# EAGLE design Board V.3 (EAGLE 7.2.0)

## Sheet 1 of 3
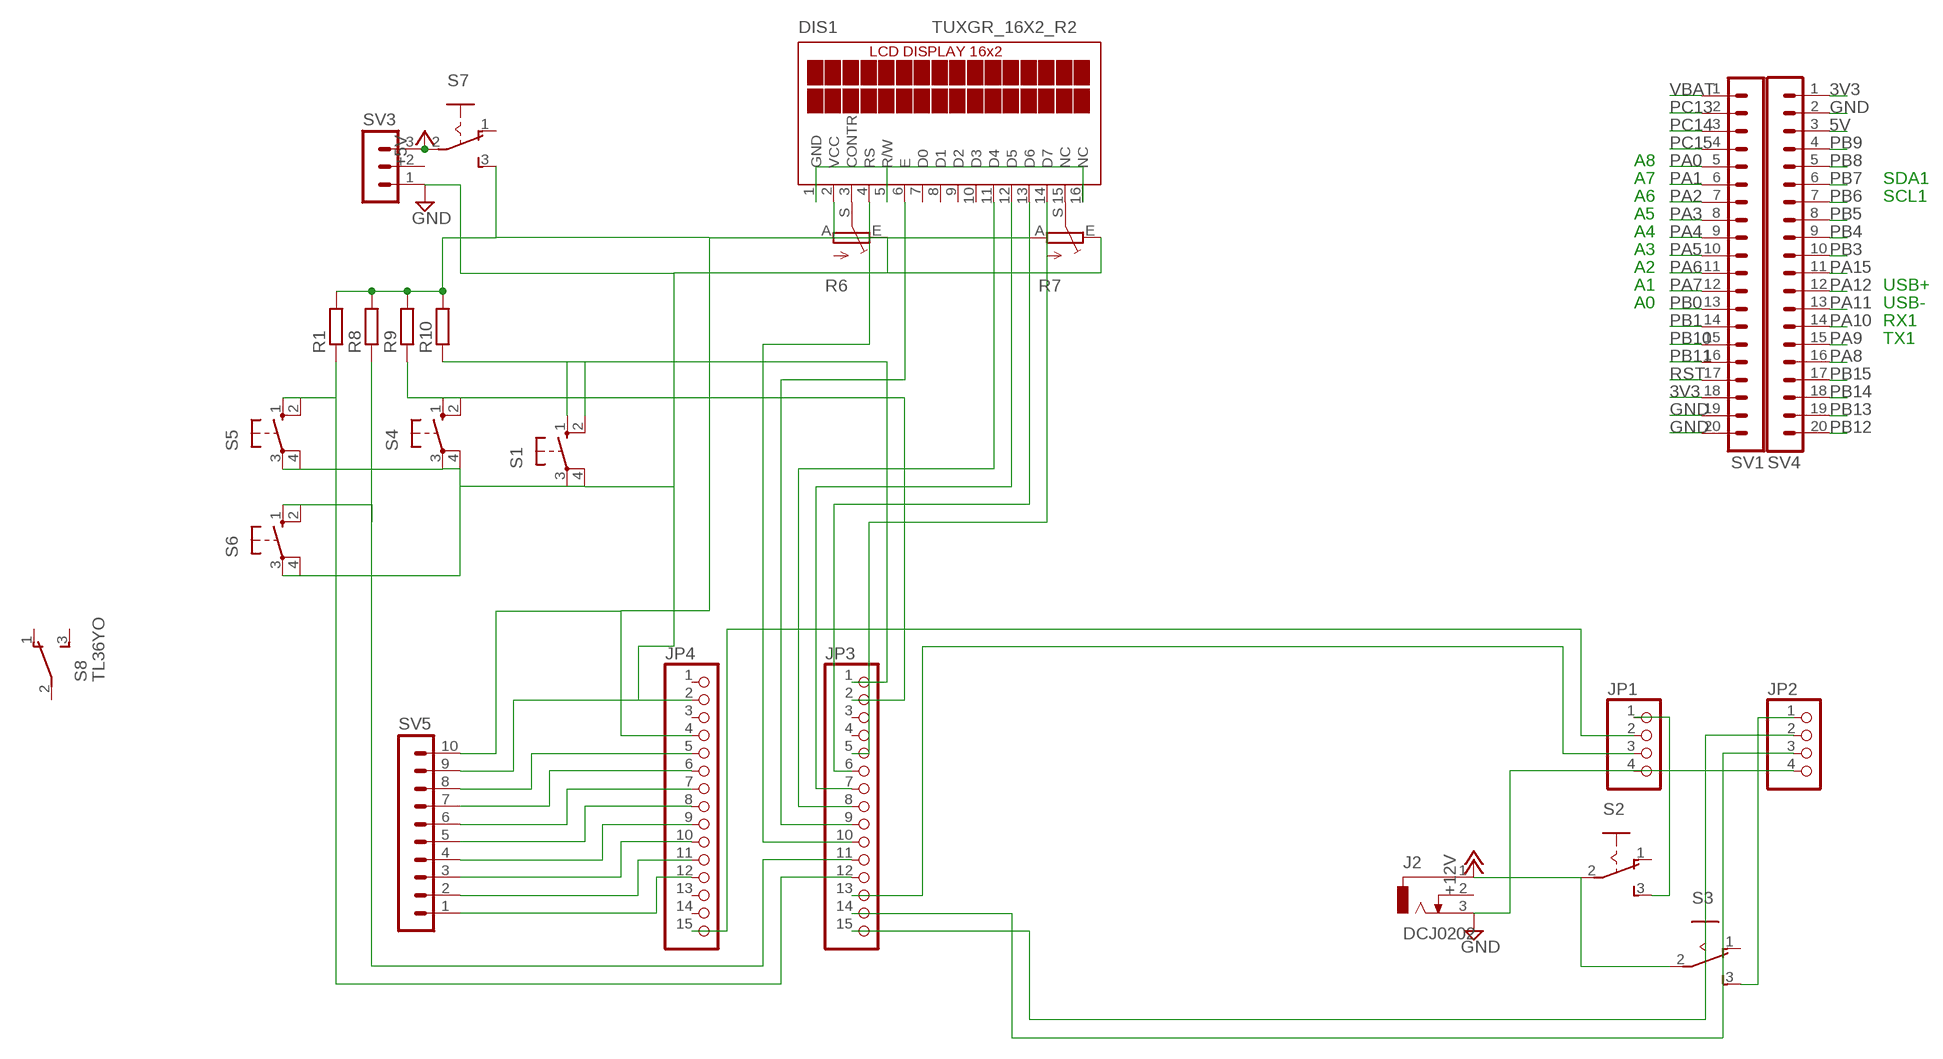
[diagram p0: schematic, sheet 1]

### Parts
DIS1  TUXGR_16X2_R2  [TUXGR_16X2_R2]
J2  DCJ0202  [DCJ0202]
JP1  PINHD-1X4  [1X04]
JP2  PINHD-1X4  [1X04]
JP3  PINHD-1X15  [1X15]
JP4  PINHD-1X15  [1X15]
R1  R-EU_0204/7  [0204/7]
R6  TRIM_EU-B25P  [B25P]
R7  TRIM_EU-B25P  [B25P]
R8  R-EU_0204/7  [0204/7]
R9  R-EU_0204/7  [0204/7]
R10  R-EU_0204/7  [0204/7]
S1  10-XX  [B3F-10XX]
S2  255SB  [255SB]
S3  255SB  [255SB]
S4  10-XX  [B3F-10XX]
S5  10-XX  [B3F-10XX]
S6  10-XX  [B3F-10XX]
S7  255SB  [255SB]
S8  TL36YO  [TL3XYO]
SV1  MA20-1L  [MA20-1L]
SV3  MA03-1  [MA03-1]
SV4  MA20-1L  [MA20-1L]
SV5  MA10-1  [MA10-1]

### Nets
3V3: SV1.18 SV4.1
5V: SV4.3
+5V: S7.2(P) SV3.3
+5V2: DIS1.2(VCC) JP4.4 R1.2 R6.A R7.A R8.2 R9.2 R10.2 S7.3(S) SV5.10
+12V: J2.1 S2.2(P) S3.2(P)
GND: J2.3 JP1.4 JP2.4 JP4.2 R6.E R7.E S1.3(P) S1.4(P1) S4.3(P) S4.4(P1) S5.3(P) S5.4(P1) S6.3(P) S6.4(P1) SV1.19 SV1.20 SV3.1 SV4.2 SV5.9
N$1: JP1.1 S2.3(S)
N$2: JP2.1 S3.3(S)
N$3: JP1.3
N$4: JP4.15
N$7: JP3.1 R10.1 S1.1(S) S1.2(S1)
N$9: DIS1.15(NC) R7.S
N$10: JP2.2
N$11: DIS1.4(RS) JP3.10
N$12: JP3.15
N$13: DIS1.3(CONTR) R6.S
N$14: DIS1.6(E) JP3.9
N$15: JP1.2
N$16: DIS1.11(D4) JP3.8
N$23: JP4.5 SV5.8
N$24: JP4.6 SV5.7
N$25: JP4.7 SV5.6
N$26: JP4.8 SV5.5
N$27: JP4.9 SV5.4
N$28: DIS1.12(D5) JP3.7
N$29: DIS1.13(D6) JP3.6
N$30: DIS1.14(D7) JP3.5
N$32: JP3.2 R9.1 S4.1(S) S4.2(S1)
N$33: JP3.11 R8.1 S6.1(S) S6.2(S1)
N$34: JP3.12 R1.1 S5.1(S) S5.2(S1)
N$36: DIS1.1(GND) DIS1.5(R/W) DIS1.16(NC)
N$40: JP3.13
N$45: JP2.3 JP3.14
N$46: JP4.10 SV5.3
N$47: JP4.11 SV5.2
N$49: JP4.12 SV5.1
PA0: SV1.5
PA1: SV1.6
PA2: SV1.7
PA3: SV1.8
PA4: SV1.9
PA5: SV1.10
PA6: SV1.11
PA7: SV1.12
PA8: SV4.16
PA9: SV4.15
PA10: SV4.14
PA11: SV4.13
PA12: SV4.12
PA15: SV4.11
PB0: SV1.13
PB1: SV1.14
PB3: SV4.10
PB4: SV4.9
PB5: SV4.8
PB6: SV4.7
PB7: SV4.6
PB8: SV4.5
PB9: SV4.4
PB10: SV1.15
PB11: SV1.16
PB12: SV4.20
PB13: SV4.19
PB14: SV4.18
PB15: SV4.17
PC13: SV1.2
PC14: SV1.3
PC15: SV1.4
RST: SV1.17
VBAT: SV1.1
Unconnected: DIS1.7(D0) DIS1.8(D1) DIS1.9(D2) DIS1.10(D3) J2.2 JP3.3 JP3.4 JP4.1 JP4.3 JP4.13 JP4.14 S2.1(O) S3.1(O) S7.1(O) S8.1(O) S8.2(P) S8.3(S) SV3.2

### Notes on the sheet
- A8
- A7 | SDA1
- A6 | SCL1
- A5
- A4
- A3
- A2
- A1 | USB+
- A0 | USB-
- RX1
- TX1

## Sheet 2 of 3
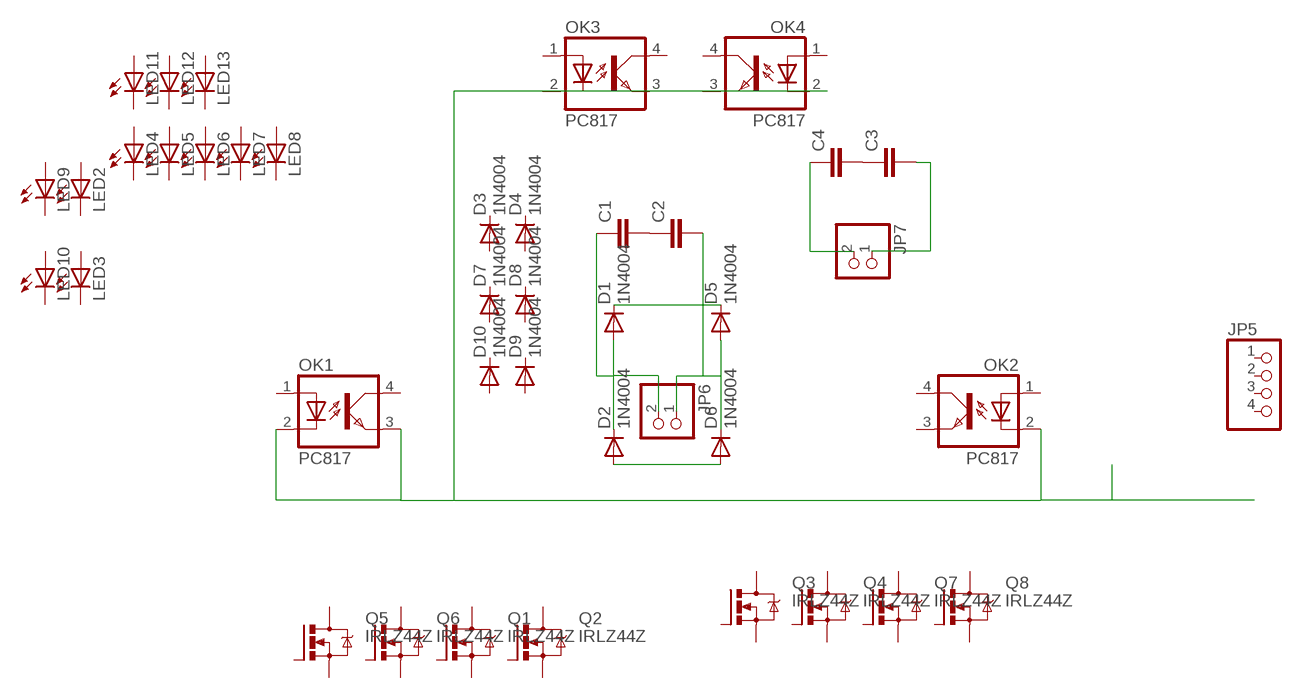
[diagram p1: schematic, sheet 2]

### Parts
C1  C-EU025-025X050  [C025-025X050]
C2  C-EU025-025X050  [C025-025X050]
C3  C-EU025-025X050  [C025-025X050]
C4  C-EU025-025X050  [C025-025X050]
D1  1N4004  [DO41-10]
D2  1N4004  [DO41-10]
D3  1N4004  [DO41-10]
D4  1N4004  [DO41-10]
D5  1N4004  [DO41-10]
D6  1N4004  [DO41-10]
D7  1N4004  [DO41-10]
D8  1N4004  [DO41-10]
D9  1N4004  [DO41-10]
D10  1N4004  [DO41-10]
JP5  PINHD-1X4  [1X04]
JP6  PINHD-1X2/90  [1X02/90]
JP7  PINHD-1X2/90  [1X02/90]
LED2  LED5MM  [LED5MM]
LED3  LED5MM  [LED5MM]
LED4  LED5MM  [LED5MM]
LED5  LED5MM  [LED5MM]
LED6  LED5MM  [LED5MM]
LED7  LED5MM  [LED5MM]
LED8  LED5MM  [LED5MM]
LED9  LED5MM  [LED5MM]
LED10  LED5MM  [LED5MM]
LED11  LED5MM  [LED5MM]
LED12  LED5MM  [LED5MM]
LED13  LED5MM  [LED5MM]
OK1  PC817  [DIL04]
OK2  PC817  [DIL04]
OK3  PC817  [DIL04]
OK4  PC817  [DIL04]
Q1  IRLZ44Z  [TO220BH]
Q2  IRLZ44Z  [TO220BH]
Q3  IRLZ44Z  [TO220BH]
Q4  IRLZ44Z  [TO220BH]
Q5  IRLZ44Z  [TO220BH]
Q6  IRLZ44Z  [TO220BH]
Q7  IRLZ44Z  [TO220BH]
Q8  IRLZ44Z  [TO220BH]

### Nets
+12V1: D1.C D5.C
GND1: OK1.2(C) OK1.3(EMIT) OK2.2(C) OK3.2(C) OK3.3(EMIT) OK4.2(C) OK4.3(EMIT)
N$17: C3.1 C4.2
N$18: D2.A D6.A
N$19: C4.1 JP7.2
N$22: C1.2 C2.1
N$58: C1.1 D1.A D2.C JP6.2
N$61: C3.2 JP7.1
N$67: C2.2 D5.A D6.C JP6.1
Unconnected: D3.A D3.C D4.A D4.C D7.A D7.C D8.A D8.C D9.A D9.C D10.A D10.C JP5.1 JP5.2 JP5.3 JP5.4 LED2.A LED2.K(C) LED3.A LED3.K(C) LED4.A LED4.K(C) LED5.A LED5.K(C) LED6.A LED6.K(C) LED7.A LED7.K(C) LED8.A LED8.K(C) LED9.A LED9.K(C) LED10.A LED10.K(C) LED11.A LED11.K(C) LED12.A LED12.K(C) LED13.A LED13.K(C) OK1.1(A) OK1.4(COL) OK2.1(A) OK2.3(EMIT) OK2.4(COL) OK3.1(A) OK3.4(COL) OK4.1(A) OK4.4(COL) Q1.D Q1.G Q1.S Q2.D Q2.G Q2.S Q3.D Q3.G Q3.S Q4.D Q4.G Q4.S Q5.D Q5.G Q5.S Q6.D Q6.G Q6.S Q7.D Q7.G Q7.S Q8.D Q8.G Q8.S

## Sheet 3 of 3

## Library data of the parts
C1-C4 = rcl:C-EU: CAPACITOR, European symbol
D1-D10 = diode:1N4004: DIODE general purpose rectifier, 1 A
DIS1 = display-lcd:TUXGR_16X2_R2: Tuxgraphics LCD display 16x2 characters reflective, without background light Source: tuxgr_12x2_r2.pdf
J2 = con-jack:DCJ0202: DC POWER JACK Source: DCJ0202.pdf
JP1 JP2 JP5 = pinhead:PINHD-1X4: PIN HEADER
JP3 JP4 = pinhead:PINHD-1X15: PIN HEADER
JP6 JP7 = pinhead:PINHD-1X2: PIN HEADER
LED2-LED13 = adafruit:LED: LED OSRAM: - CHIPLED LG R971, LG N971, LY N971, LG Q971, LY Q971, LO R971, LY R971 LH N974, LH R974 LS Q976, LO Q976, LY Q976 LO Q996 - Hyper CHIPLED LW Q18S LB Q993, LB Q99A, LB R99A - SideLED LS A670, LO A670, LY A670, LG A670, LP A670 LB A673, LV A673, LT A673, LW A673 LH A674 LY A675 LS A676, LA A676, LO A676, LY A676, LW A676 LS A679, LY A679, LG A679 - Hyper Micro SIDELED® LS Y876, LA Y876, LO Y876, LY Y876 LT Y87S - SmartLED LW L88C, LW L88S LB L89C, LB L89S, LG L890 LS L89K, LO L89K, LY L89K LS L896, LA L896, LO L896, LY L896 - TOPLED LS T670, LO T670, LY T670, LG T670, LP T670 LSG T670, LSP T670, LSY T670, LOP T670, LYG T670 LG T671, LOG T671, LSG T671 LB T673, LV T673, LT T673, LW T673 LH T674 LS T676, LA T676, LO T676, LY T676, LB T676, LH T676, LSB T676, LW T676 LB T67C, LV T67C, LT T67C, LS T67K, LO T67K, LY T67K, LW E67C LS E67B, LA E67B, LO E67B, LY E67B, LB E67C, LV E67C, LT E67C LW T67C LS T679, LY T679, LG T679 LS T770, LO T770, LY T770, LG T770, LP T770 LB T773, LV T773, LT T773, LW T773 LH T774 LS E675, LA E675, LY E675, LS T675 LS T776, LA T776, LO T776, LY T776, LB T776 LHGB T686 LT T68C, LB T68C - Hyper Mini TOPLED® LB M676 - Mini TOPLED Santana® LG M470 LS M47K, LO M47K, LY M47K Source: http://www.osram.convergy.de/
OK1-OK4 = optocoupler:PC817: SHARP OPTO COUPLER; MPN: PC817X4J000F; OC_FARNELL: 9707727; OC_NEWARK: 97K7059
Q1-Q8 = transistor-power:IRLZ44Z: N-Channel HEXFET® Power MOSFET Logic Level AUTOMOTIVE MOSFET Source: http://www.irf.com/product-info/datasheets/data/irlz44zpbf.pdf
R1 R8-R10 = resistor:R-EU_: RESISTOR, European symbol
R6 R7 = pot:TRIM_EU-: POTENTIOMETER
S1 S4-S6 = switch-omron:10-XX: OMRON SWITCH
S2 S3 S7 = switch:255SB: SLIDING SWITCH Distributor Buerklin, 11G810
S8 = switch:TL36YO: TINY SWITCH ON - ON Source: http://www2.produktinfo.conrad.com/datenblaetter/700000-724999/705152-da-01-de-Subminiaturschalter_TL_36YO.pdf
SV1 SV4 = con-lstb:MA20-1L: PIN HEADER; OC_FARNELL: unknown; OC_NEWARK: unknown
SV3 = con-lstb:MA03-1: PIN HEADER
SV5 = con-lstb:MA10-1: PIN HEADER

## Net classes
0 default: width 0.051 mm, clearance 0.051 mm

## Board
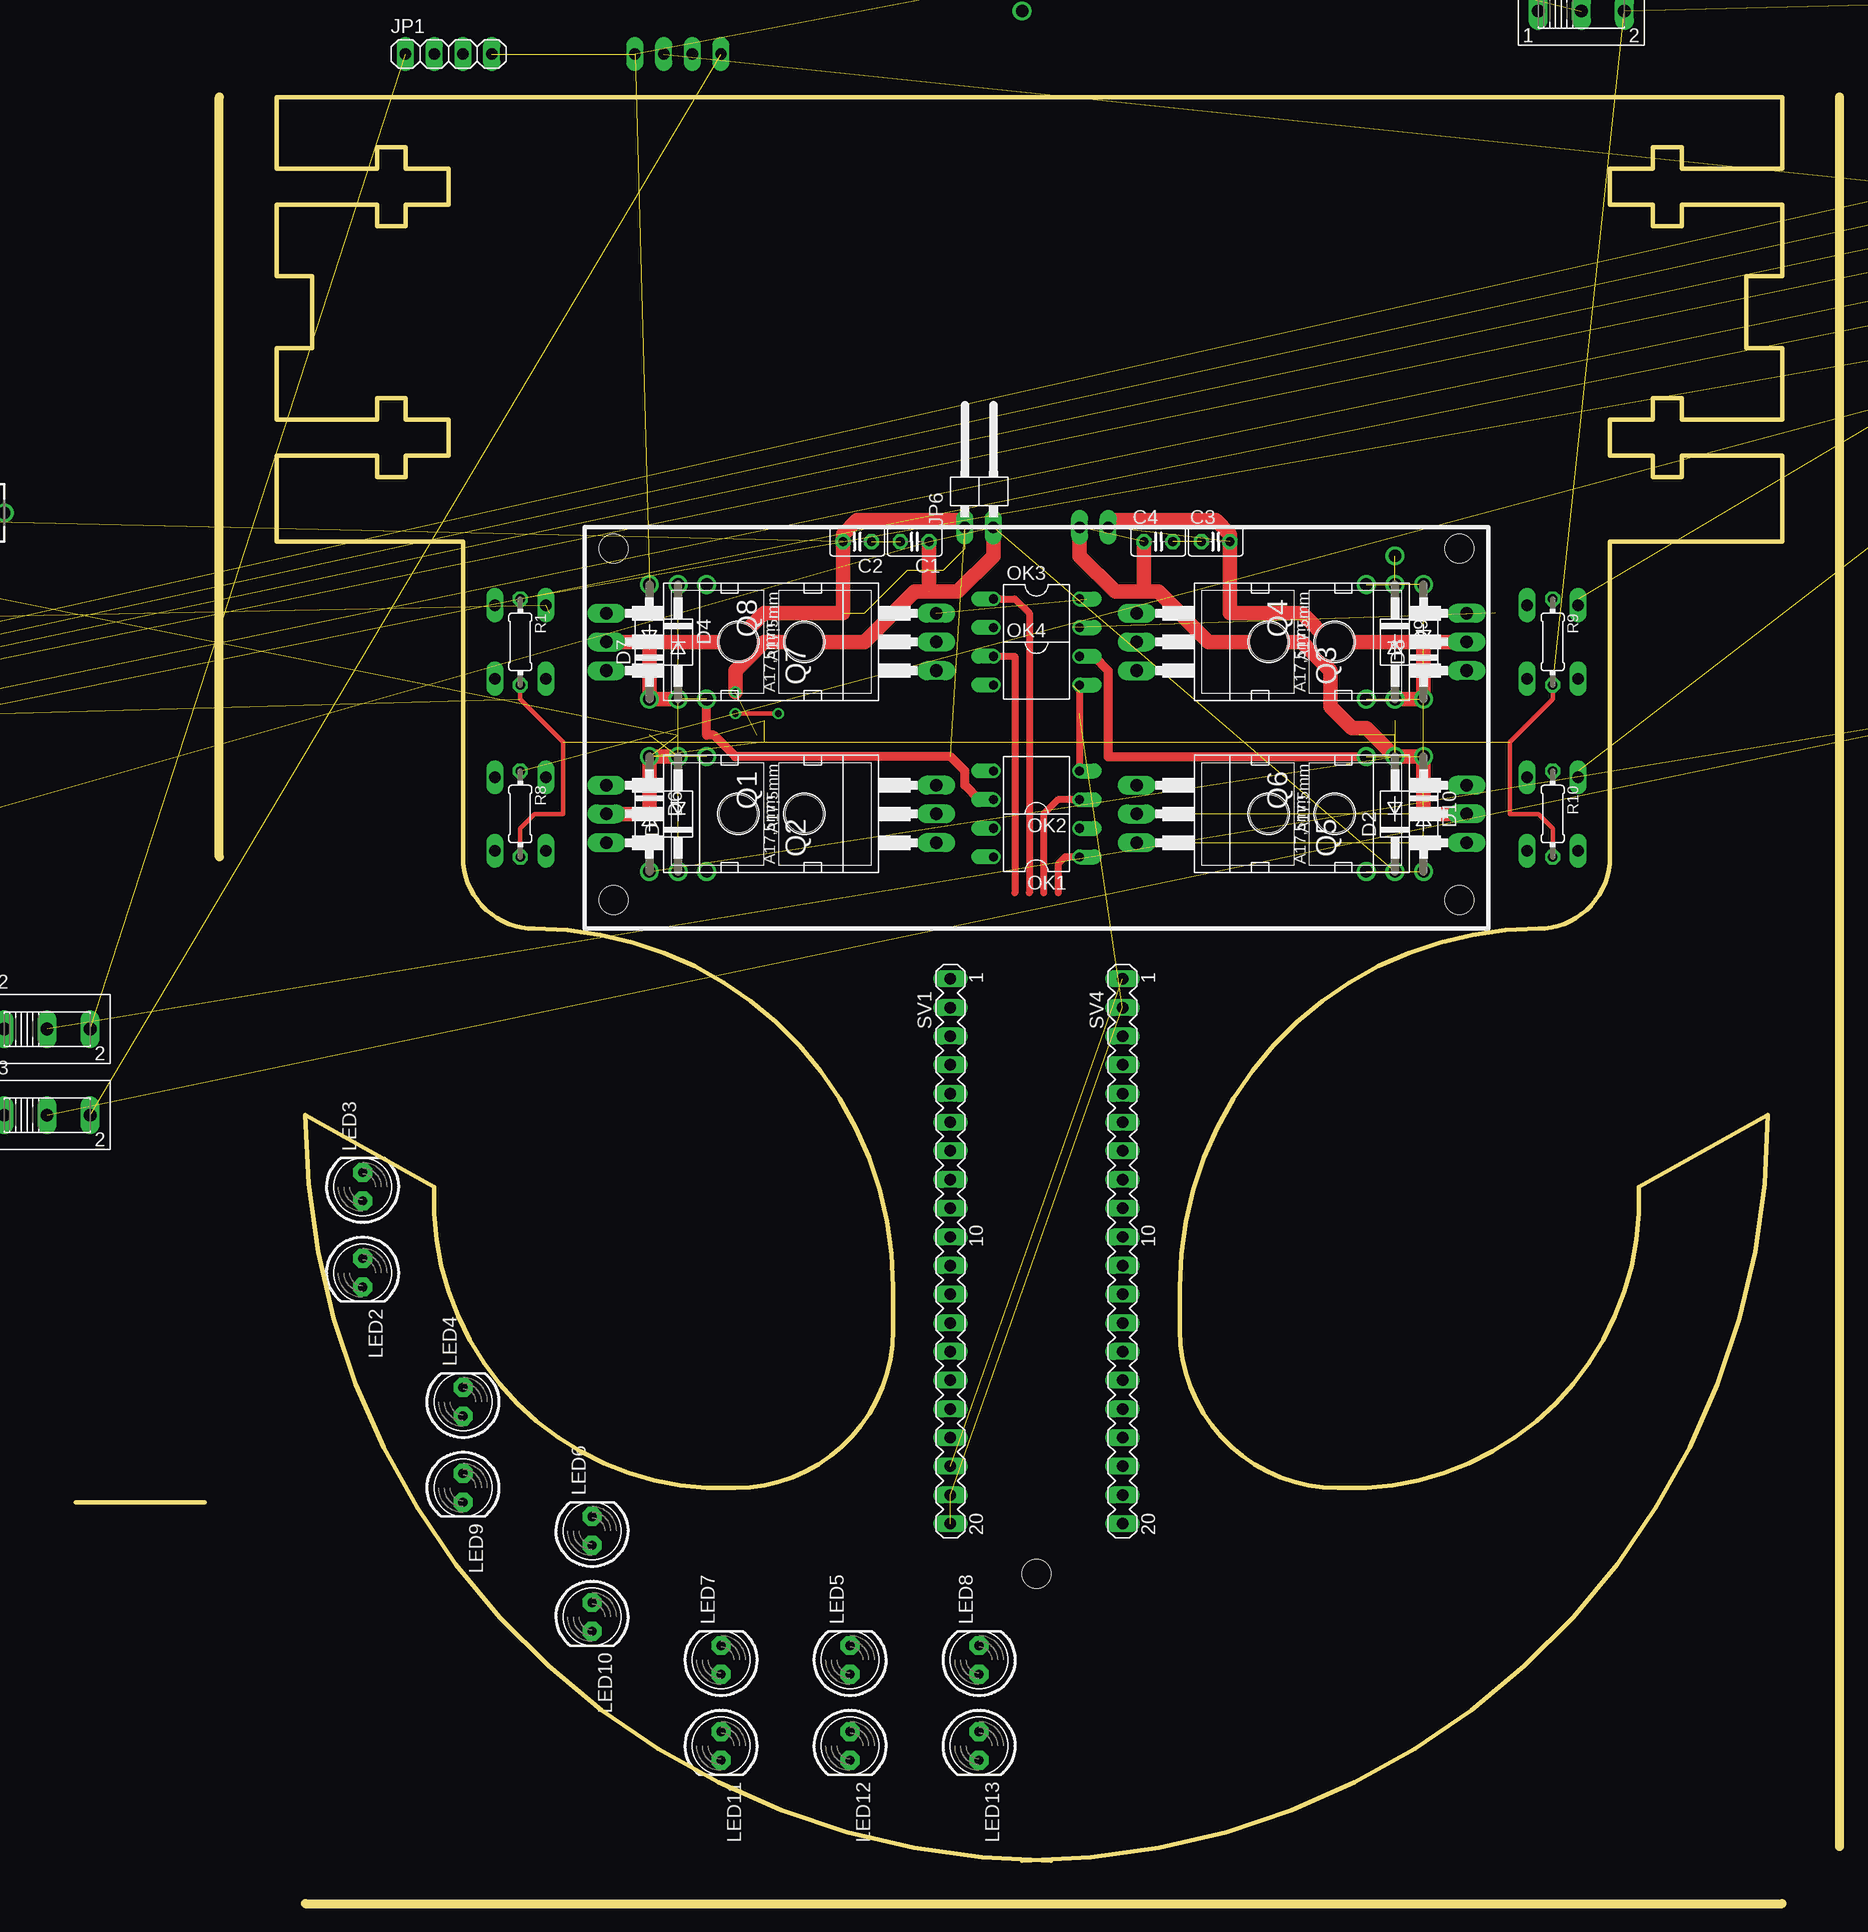
[diagram p2: board, top side]
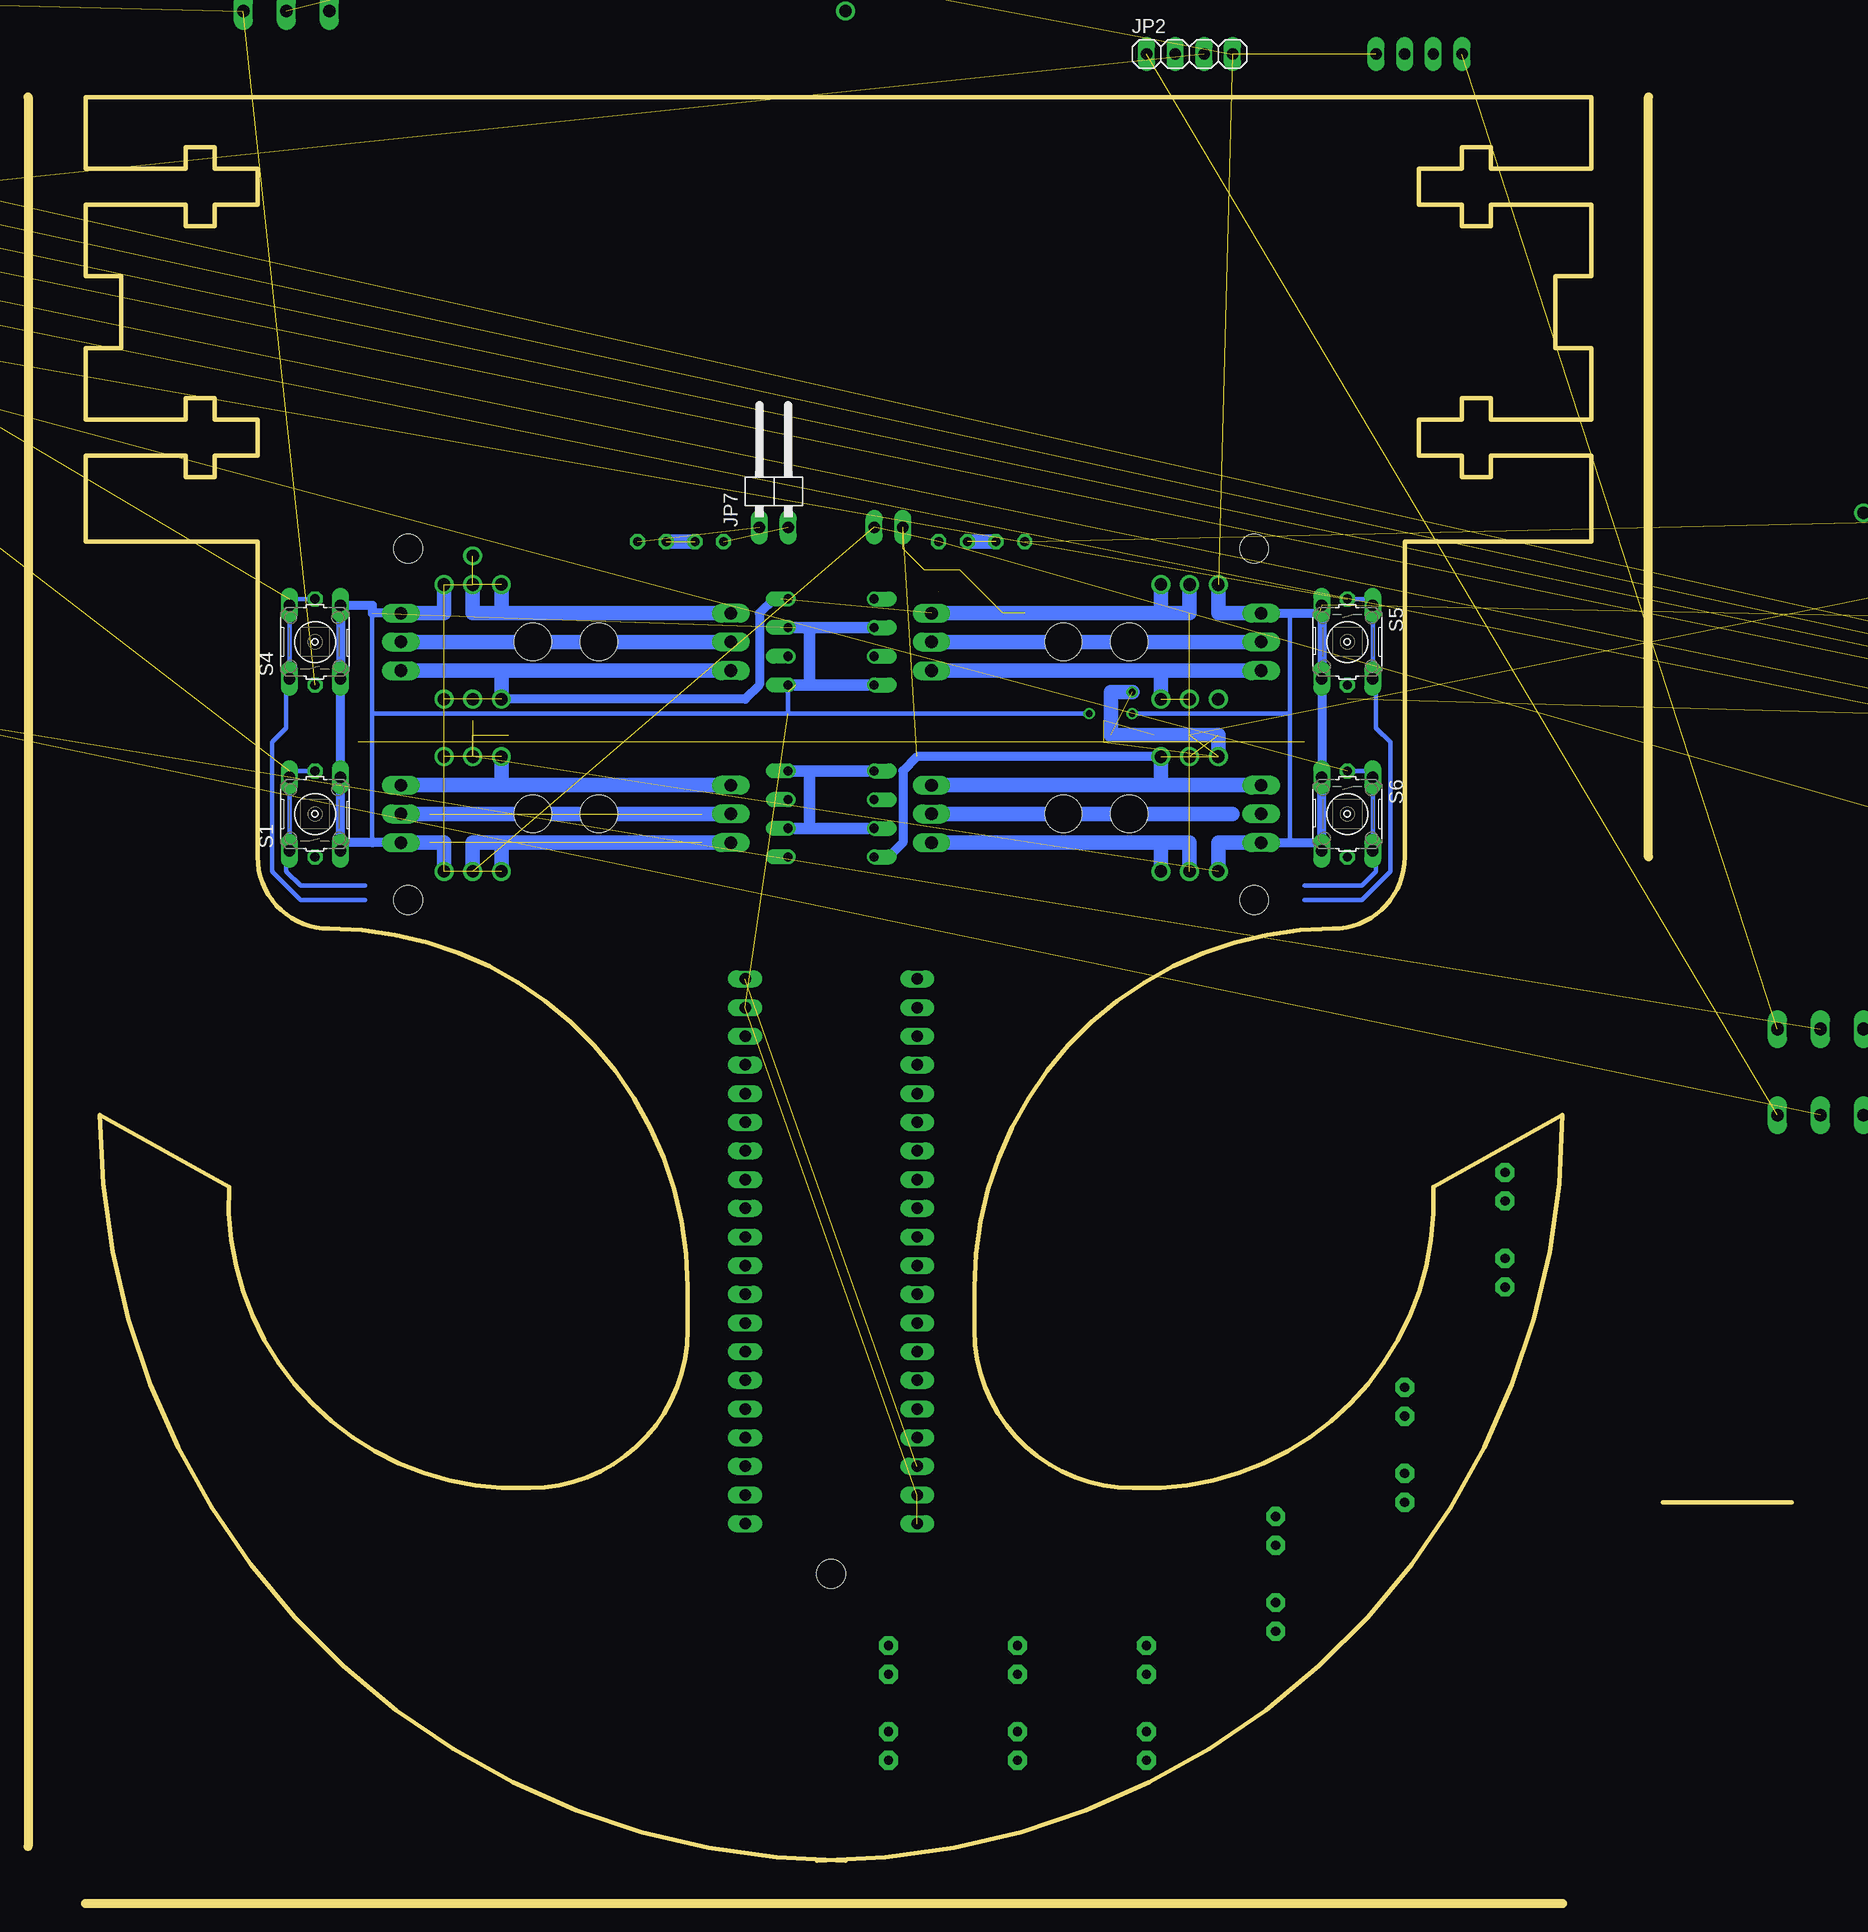
[diagram p3: board, bottom side, seen from below]

Size 156.21 x 160.02 mm. Coordinates in mm from the lower left corner, seen from the top.
Outline: 86.36,3.81 arc-90 20.32,69.85 31.75,63.5 arc90 55.88,36.83 58.42,36.83 arc90 72.39,50.8 72.39,54.61 arc90 40.64,86.36 arc-90 34.29,92.71 34.29,120.65 17.78,120.65 17.78,128.27 26.67,128.27 26.67,126.37 29.21,126.37 29.21,128.27 33.02,128.27 33.02,131.44 29.21,131.44 29.21,133.35 26.67,133.35 26.67,131.44 17.78,131.44 17.78,137.8 20.96,137.8 20.96,144.15 17.78,144.15 17.78,150.5 26.67,150.5 26.67,148.59 29.21,148.59 29.21,150.5 33.02,150.5 33.02,153.67 29.21,153.67 29.21,155.57 26.67,155.57 26.67,153.67 17.78,153.67 17.78,160.02 151.13,160.02 151.13,153.67 142.24,153.67 142.24,155.57 139.7,155.57 139.7,153.67 135.89,153.67 135.89,150.5 139.7,150.5 139.7,148.59 142.24,148.59 142.24,150.5 151.13,150.5 151.13,144.15 147.96,144.15 147.96,137.8 151.13,137.8 151.13,131.44 142.24,131.44 142.24,133.35 139.7,133.35 139.7,131.44 135.89,131.44 135.89,128.27 139.7,128.27 139.7,126.37 142.24,126.37 142.24,128.27 151.13,128.27 151.13,120.65 135.89,120.65 135.89,92.71 arc-90 129.54,86.36 arc90 97.79,54.61 97.79,50.8 arc90 111.76,36.83 114.3,36.83 arc90 138.43,63.5 149.86,69.85 arc-90 83.82,3.81
Outline: 156.21,160.02 156.21,5.08
Outline: 20.32,0 151.13,0
Outline: 12.7,92.71 12.7,160.02
Outline: 0,35.56 11.43,35.56
Copper layers (1*16): Top 0.035mm / dielectric 1.5mm / Bottom 0.035mm
Design rules "default *": minimum track width 20mil, minimum drill 24mil, track to track 8mil, track to pad 8mil, pad to pad 8mil, via to via 8mil, smd to smd 8mil, copper to edge 40mil, drill to drill 8mil, minimum pad ring 10mil, minimum via ring 8mil, stop-mask expansion 4mil, vias tented up to drill 0mil, thermal gap 10mil
Holes 2.54 mm at 85.09,29.21 47.62,88.9 47.62,120.02 122.56,120.02 122.56,88.9

### Footprints (pad centres in the part's own frame; a part is rotated, then mirrored left to right if it is on the bottom)
C025-025X050 = drill 0.813 octagon: 1 -1.27,0; 2 1.27,0
DO41-10 = drill 1.118: A 5.08,0; C -5.08,0
TUXGR_16X2_R2 = drill 1 pad 1.676: 1 -32,15.5; 2 -29.46,15.5; 3 -26.92,15.5; 4 -24.38,15.5; 5 -21.84,15.5; 6 -19.3,15.5; 7 -16.76,15.5; 8 -14.22,15.5; 9 -11.68,15.5; 10 -9.14,15.5; 11 -6.6,15.5; 12 -4.06,15.5; 13 -1.52,15.5; 14 1.02,15.5; 15 3.56,15.5; 16 6.1,15.5 | hole 2.5: -37.5,-15.5; 37.5,-15.5; -37.5,15.5; 37.5,15.5
DCJ0202 = drill 1 pad 2 long: 1 0,3.1; 2 4.8,0; 3 0,-3
1X04 = drill 1.016 long: 1 -3.81,0; 2 -1.27,0; 3 1.27,0; 4 3.81,0
1X15 = drill 1.016 long: 1 -17.78,0; 2 -15.24,0; 3 -12.7,0; 4 -10.16,0; 5 -7.62,0; 6 -5.08,0; 7 -2.54,0; 8 0,0; 9 2.54,0; 10 5.08,0; 11 7.62,0; 12 10.16,0; 13 12.7,0; 14 15.24,0; 15 17.78,0
1X02/90 = drill 1.016 long: 1 -1.27,-3.81; 2 1.27,-3.81
LED5MM = drill 0.813 pad 1.676 octagon: A -1.27,0; K 1.27,0
DIL04 = drill 0.813 offset: 1 -1.27,-3.81; 2 1.27,-3.81; 3 1.27,3.81; 4 -1.27,3.81
TO220BH = drill 1.118 long: D 0,-6.35; G -2.54,-6.35; S 2.54,-6.35 | hole 3.302: 0,11.176
0204/7 = drill 0.813 octagon: 1 -3.81,0; 2 3.81,0
B25P = drill 0.813 octagon: A -2.54,0; E 2.54,0; S 0,2.54
B3F-10XX = drill 1.016 long: 1 -3.251,2.261; 2 3.251,2.261; 3 -3.251,-2.261; 4 3.251,-2.261
255SB = drill 1.118 long: 1 -3.81,0; 2 0,0; 3 3.81,0
TL3XYO = drill 1.1 pad 1.422 long: 1 -2.54,0; 2 0,0; 3 2.54,0 | drill 1.1 pad 1.676: M1 -5.08,0; M2 5.08,0
MA20-1L = drill 1.016 long: 1 24.13,0; 2 21.59,0; 3 19.05,0; 4 16.51,0; 5 13.97,0; 6 11.43,0; 7 8.89,0; 8 6.35,0; 9 3.81,0; 10 1.27,0; 11 -1.27,0; 12 -3.81,0; 13 -6.35,0; 14 -8.89,0; 15 -11.43,0; 16 -13.97,0; 17 -16.51,0; 18 -19.05,0; 19 -21.59,0; 20 -24.13,0
MA03-1 = drill 1.016 long: 1 -2.54,0; 2 0,0; 3 2.54,0
MA10-1 = drill 1.016 long: 1 -11.43,0; 2 -8.89,0; 3 -6.35,0; 4 -3.81,0; 5 -1.27,0; 6 1.27,0; 7 3.81,0; 8 6.35,0; 9 8.89,0; 10 11.43,0

### Placement (x,y rotation side)
C1  74.3,120.65 180 top
C2  69.22,120.65 180 top
C3  100.97,120.65 0 top
C4  95.88,120.65 0 top
D1  -17.78,99.06 270 top  (outside the outline)
D2  116.84,96.52 90 top
D3  53.34,96.52 90 top
D4  53.34,111.76 270 top
D5  -44.45,118.11 90 top  (outside the outline)
D6  50.8,96.52 270 top
D7  50.8,111.76 90 top
D8  119.38,111.76 90 top
D9  116.84,111.76 270 top
D10  119.38,96.52 270 top
DIS1  -105.41,106.68 180 top  (outside the outline)
J2  171.45,109.22 180 top  (outside the outline)
JP1  33.02,163.83 0 top  (outside the outline)
JP2  53.34,163.83 0 bottom  (outside the outline)
JP3  233.68,160.02 270 top  (outside the outline)
JP4  240.03,160.02 270 top  (outside the outline)
JP5  -87.63,144.78 270 top  (outside the outline)
JP6  80.01,125.73 0 top
JP7  90.17,125.73 0 bottom
LED2  25.4,55.88 270 top
LED3  25.4,63.5 90 top
LED4  34.29,44.45 90 top
LED5  68.58,21.59 90 top
LED6  45.72,33.02 90 top
LED7  57.15,21.59 90 top
LED8  80.01,21.59 90 top
LED9  34.29,36.83 270 top
LED10  45.72,25.4 270 top
LED11  57.15,13.97 270 top
LED12  68.58,13.97 270 top
LED13  80.01,13.97 270 top
OK1  85.09,93.98 90 top
OK2  85.09,99.06 90 top
OK3  85.09,114.3 270 top
OK4  85.09,109.22 270 top
Q1  53.34,96.52 270 top
Q2  69.85,96.52 90 top
Q3  116.84,111.76 90 top
Q4  100.33,111.76 270 top
Q5  116.84,96.52 90 top
Q6  100.33,96.52 270 top
Q7  69.85,111.76 90 top
Q8  53.34,111.76 270 top
R1  39.37,111.76 270 top
R6  -55.88,113.03 180 top  (outside the outline)
R7  -55.88,104.14 180 top  (outside the outline)
R8  39.37,96.52 270 top
R9  130.81,111.76 270 top
R10  130.81,96.52 270 top
S1  130.81,96.52 90 bottom
S2  -2.54,77.47 0 top
S3  -2.54,69.85 0 top
S4  130.81,111.76 90 bottom
S5  39.37,111.76 270 bottom
S6  39.37,96.52 270 bottom
S7  133.35,167.64 0 top  (outside the outline)
S8  -11.43,123.19 0 top  (outside the outline)
SV1  77.47,57.78 90 top
SV3  105.41,173.99 0 top  (outside the outline)
SV4  92.71,57.78 90 top
SV5  246.38,161.29 90 top  (outside the outline)

### Tracks (layer width: path | path; a pad name or v marks a point on that pad's centre or on a via)
3V3  (1 unrouted)
+5V  (1 unrouted)
+5V2  (7 unrouted)
  Top 0.406: R9.2 130.81,106.68 127,102.87 127,96.52 129.54,96.52 130.81,95.25 R10.2 | R1.2 39.37,106.68 43.18,102.87 43.18,96.52 40.64,96.52 39.37,95.25 R8.2
+12V  (2 unrouted)
+12V1  (1 unrouted)
GND  (via drill 0.6, 1.1 pad 1.68)  (13 unrouted)
  Top 0.406: v58.42,105.41 v62.23,105.41
  Bottom 0.406: 44.45,114.3 44.45,105.41 | 44.45,105.41 v58.42,105.41 | v62.23,105.41 88.9,105.41 | 88.9,105.41 125.73,105.41 | 125.73,105.41 125.73,114.3 | 125.73,105.41 125.73,93.98 | 88.9,105.41 88.9,107.31 89.53,107.95 | 44.45,105.41 44.45,93.98
  Bottom 0.813: S6.4 S6.3 41.63,107.95 | S5.4 41.91,108.51 41.91,107.95 41.63,107.95 | S5.3 41.63,107.95 | 46.99,114.3 44.45,114.3 41.91,114.3 | 123.19,114.3 125.73,114.3 125.73,115.01 S4.4 S4.3 S1.4 128.55,93.98 | 123.19,93.98 125.73,93.98 128.55,93.98 | 46.99,93.98 44.45,93.98 41.91,93.98 | S1.3 128.55,93.98
  Bottom 1.016: 88.26,113.03 87,113.03 | 87,113.03 81.91,113.03 | 88.26,107.95 87,107.95 | 87,107.95 81.91,107.95 | 87,113.03 87,107.95
  Bottom 1.27: 46.99,114.3 50.8,114.3 v50.8,116.84 | 123.19,114.3 119.38,114.3 119.38,116.84 | 123.19,93.98 119.38,93.98 119.38,91.44 | 46.99,93.98 50.8,93.98 v50.8,91.44
GND1
  Top 0.61: OK4.3 OK2.2
  Bottom 0.813: OK3.3 87,113.03 | 87,107.95 OK4.3 | OK3.2 87,113.03 | 87,113.03 87,107.95 | 87,107.95 OK4.2 | OK1.3 OK1.2 87,95.25
  Bottom 1.016: OK2.2 87,100.33 | 87,100.33 81.91,100.33 | 88.26,95.25 87,95.25 | 87,95.25 81.91,95.25 | 87,100.33 87,95.25
N$1  (1 unrouted)
N$2  (1 unrouted)
N$5
  Top 0.61: 81.91,110.49 83.19,110.49 83.19,89.53
N$6  (1 unrouted)
N$7  (1 unrouted)
  Bottom 0.406: R10.1 133.07,100.33 S1.2 S1.1
N$8
  Top 0.61: 81.91,115.57 83.19,115.57 84.46,114.3 84.46,89.53
N$9  (1 unrouted)
N$11  (1 unrouted)
N$13  (1 unrouted)
N$14  (1 unrouted)
N$16  (1 unrouted)
N$17  (1 unrouted)
  Bottom 1.27: C3.1 C4.2
N$18  (1 unrouted)
N$19  (1 unrouted)
  Top 1.27: JP7.2 88.9,119.38 92.07,116.2 94.62,116.2 | 94.62,116.2 95.88,116.2 100.33,111.76 108.59,111.76 111.12,109.22 111.12,106.05 113.03,104.14 114.3,104.14 116.21,102.23 | 94.62,116.2 C4.1
N$20
  Top 0.61: 88.26,97.79 87,97.79 85.72,96.52 85.72,89.53
N$21
  Top 0.61: 88.26,92.71 87.63,92.71 87,92.08 87,89.53
N$22  (1 unrouted)
  Bottom 1.27: C1.2 C2.1
N$23  (1 unrouted)
N$24  (1 unrouted)
N$25  (1 unrouted)
N$26  (1 unrouted)
N$27  (1 unrouted)
N$28  (1 unrouted)
N$29  (1 unrouted)
N$30  (1 unrouted)
N$31
  Bottom 0.406: 36.83,107.95 36.83,104.14 35.56,102.87 35.56,91.44 38.1,88.9 43.18,88.9
N$32  (1 unrouted)
  Bottom 0.406: R9.1 133.07,115.57 S4.2 S4.1
N$33  (1 unrouted)
  Bottom 0.406: S6.2 S6.1 37.11,100.33 R8.1
N$34  (1 unrouted)
  Bottom 0.406: R1.1 37.11,115.57 S5.1 S5.2
N$35  (1 unrouted)
N$36  (2 unrouted)
N$37  (via drill 1.1 pad 1.68)
  Bottom 1.27: 46.99,99.06 55.88,99.06 | 55.88,99.06 76.2,99.06 | 55.88,99.06 v55.88,101.6
N$38
  Bottom 1.27: 76.2,96.52 49.53,96.52
N$39
  Bottom 0.406: 36.83,92.71 36.83,91.44 38.1,90.17 43.18,90.17
N$41
  Bottom 0.406: 133.35,107.95 133.35,104.14 134.62,102.87 134.62,91.44 132.08,88.9 126.37,88.9
N$42
  Bottom 1.27: 123.19,99.06 114.3,99.06 | 114.3,99.06 93.98,99.06 | 114.3,99.06 114.3,101.6
N$43  (via drill 1.1 pad 1.68)
  Bottom 1.27: 76.2,93.98 55.88,93.98 | 55.88,93.98 53.34,93.98 53.34,91.44 | 55.88,93.98 v55.88,91.44
N$44
  Bottom 1.27: 93.98,96.52 123.19,96.52
N$45  (1 unrouted)
N$46  (1 unrouted)
N$47  (1 unrouted)
N$48
  Bottom 1.27: 93.98,93.98 114.3,93.98 | 114.3,93.98 114.3,91.44 | 114.3,93.98 116.84,93.98 116.84,91.44
N$49  (1 unrouted)
N$50
  Bottom 0.406: 133.35,93.34 133.35,91.44 132.08,90.17 126.37,90.17
N$52  (via drill 1.1 pad 1.68)
  Bottom 1.27: 46.99,109.22 55.88,109.22 | 55.88,109.22 76.2,109.22 | 55.88,109.22 v55.88,106.68
N$53
  Bottom 1.27: 76.2,111.76 46.99,111.76
N$54
  Bottom 1.27: 93.98,109.22 114.3,109.22 | 114.3,109.22 123.19,109.22 | 114.3,109.22 114.3,106.68
N$55
  Bottom 1.27: 123.19,111.76 93.98,111.76
N$58  (via drill 0.6, 1.1 pad 1.68)  (21 unrouted)
  Top 1.27: v58.42,107.31 58.42,109.22 60.96,111.76 69.85,111.76 74.3,116.2 75.56,116.2 | 75.56,116.2 78.1,116.2 81.28,119.38 JP6.2 | 75.56,116.2 C1.1 | 46.99,96.52 50.8,96.52 v50.8,101.6 v53.34,101.6
  Bottom 0.813: 89.53,115.57 90.17,115.57 91.44,114.3 91.44,107.95 92.71,106.68 v114.3,106.68
  Bottom 1.27: 76.2,114.3 55.88,114.3 | 55.88,114.3 55.88,116.84 | 55.88,114.3 53.34,114.3 v53.34,116.84 | v50.8,101.6 50.8,103.5 60.33,103.5 60.33,107.31 v58.42,107.31
  other vias: 116.84,119.38 116.84,106.68 119.38,101.6 114.3,101.6 119.38,91.44 114.3,91.44 119.38,116.84 116.84,116.84 114.3,116.84 119.38,106.68 53.34,91.44 116.84,101.6 116.84,91.44
N$59
  Bottom 1.27: 93.98,114.3 114.3,114.3 | 114.3,114.3 114.3,116.84 | 114.3,114.3 116.84,114.3 116.84,116.84
N$61  (1 unrouted)
  Top 1.27: 123.19,111.76 119.38,111.76 | 119.38,111.76 119.38,106.68 116.84,106.68 | JP7.1 92.07,122.56 100.97,122.56 102.24,121.28 C3.2 102.24,114.3 108.59,114.3 111.12,111.76 119.38,111.76
N$62  (via drill 1.1 pad 1.68)
  other vias: 55.88,116.84
N$63  (via drill 1.1 pad 1.68)
  other vias: 83.82,167.64
N$64  (4 unrouted)
  Top 0.813: 89.53,110.49 90.17,110.49 91.44,109.22 91.44,101.6 114.3,101.6
  Top 1.27: 122.56,96.52 119.38,96.52 119.38,101.6 116.84,101.6
N$67  (via drill 1.1 pad 1.68)  (15 unrouted)
  Top 0.813: 80.65,97.79 80.01,97.79 78.74,99.06 78.74,100.33 77.47,101.6 58.42,101.6 56.52,103.5 55.88,103.5 55.88,106.68
  Top 1.27: 46.99,111.76 50.8,111.76 | 50.8,111.76 v50.8,106.68 v53.34,106.68 | 50.8,111.76 58.42,111.76 60.96,114.3 67.94,114.3 C2.2 67.94,121.28 69.22,122.56 78.1,122.56 JP6.1
  Bottom 0.813: 80.65,92.71 80.01,92.71 78.74,93.98 78.74,100.33 77.47,101.6 55.88,101.6

### Text on the board
Top: Line Follower Alakazam V.1